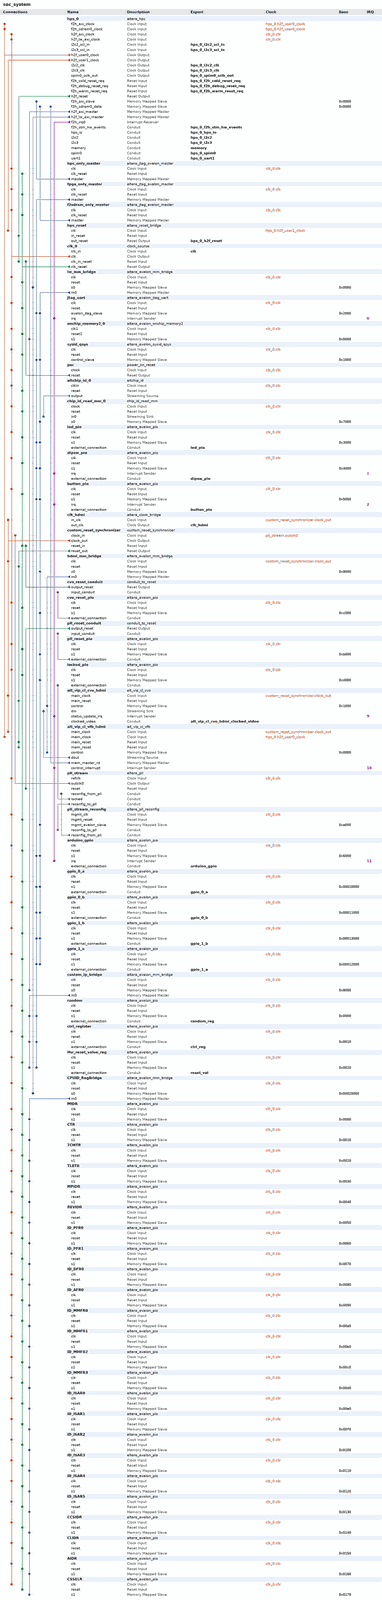
[diagram p0: system contents, whole]
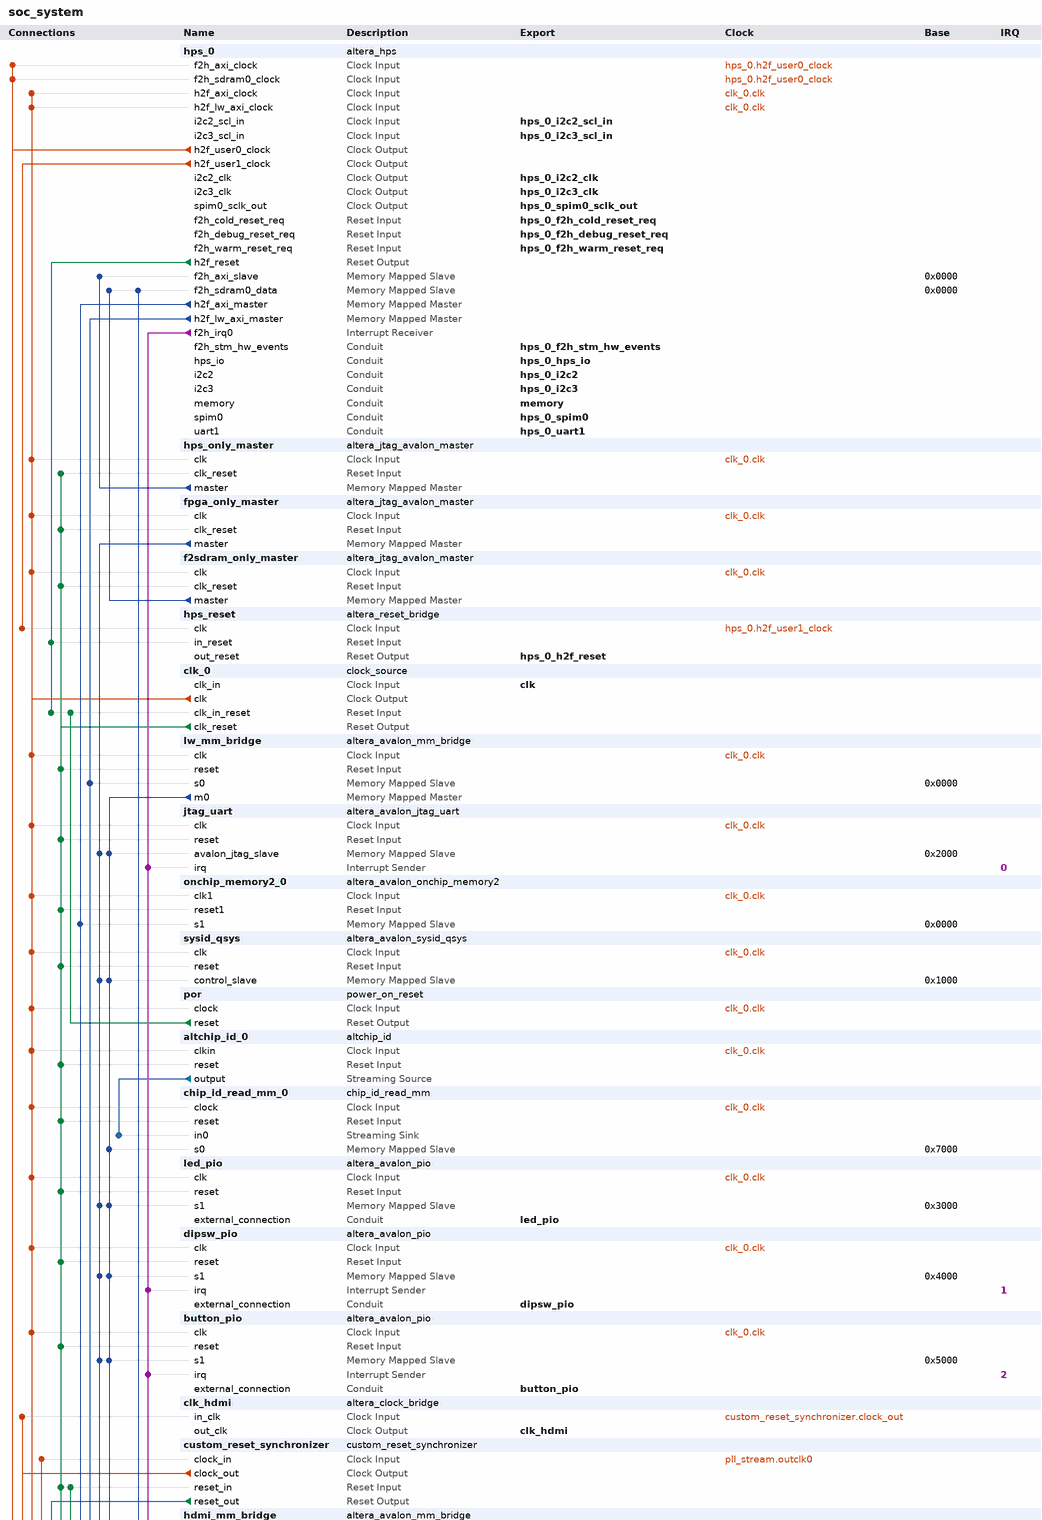
[diagram p1: system contents, upper part]
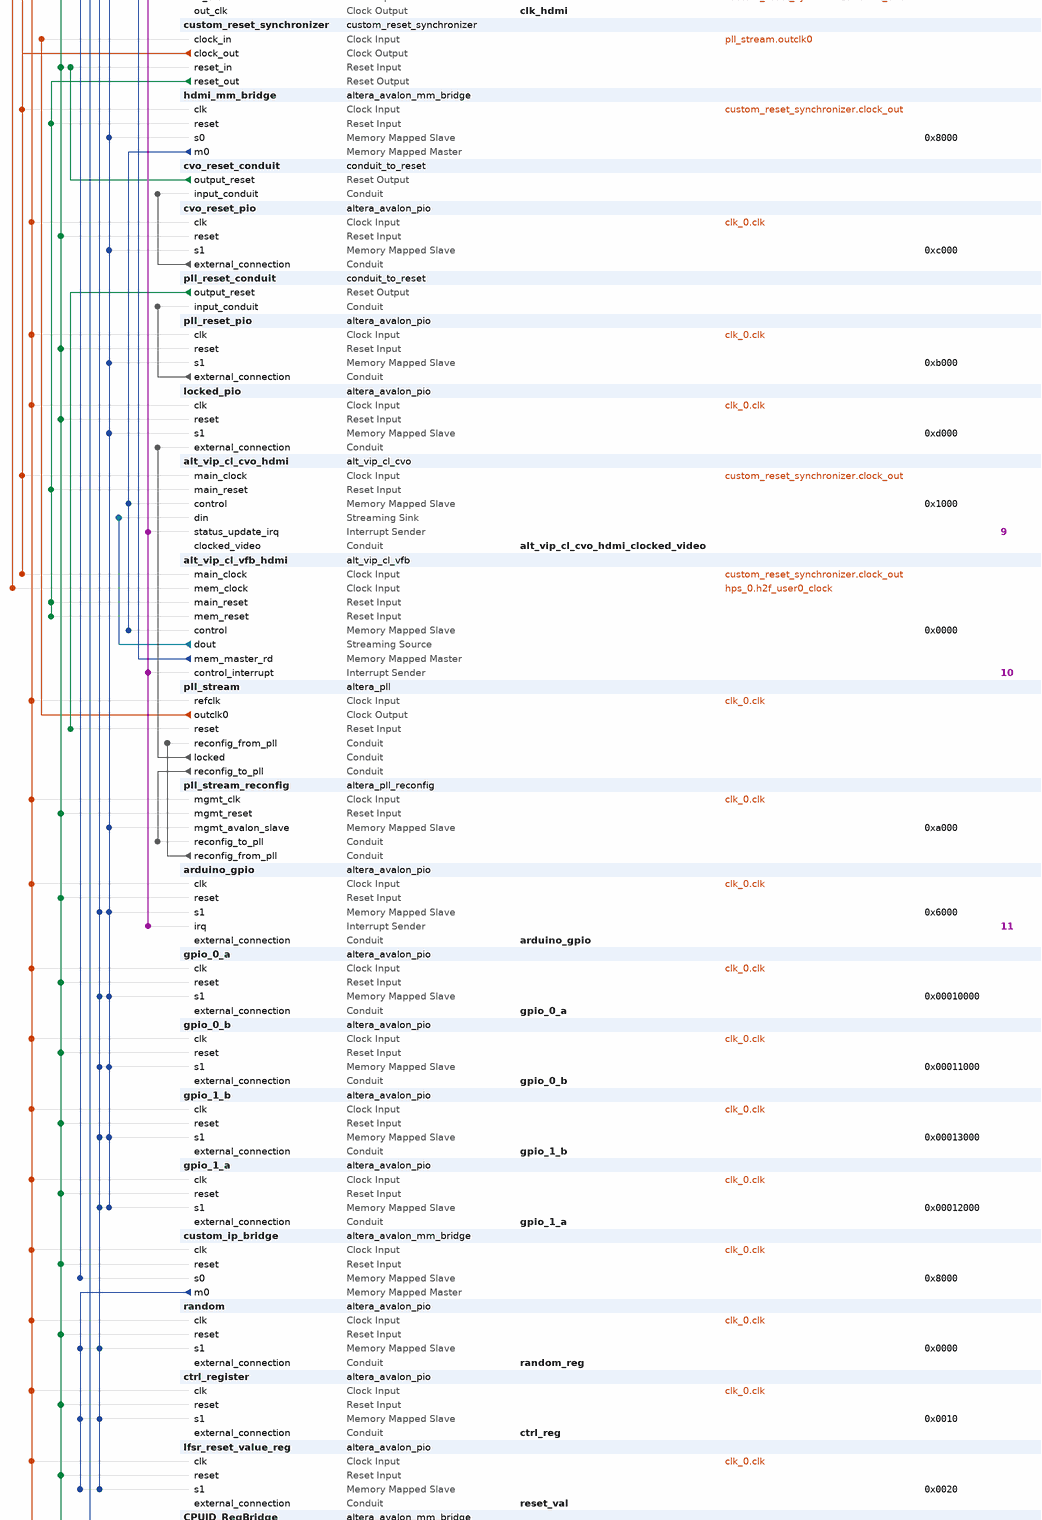
[diagram p2: system contents, middle part]
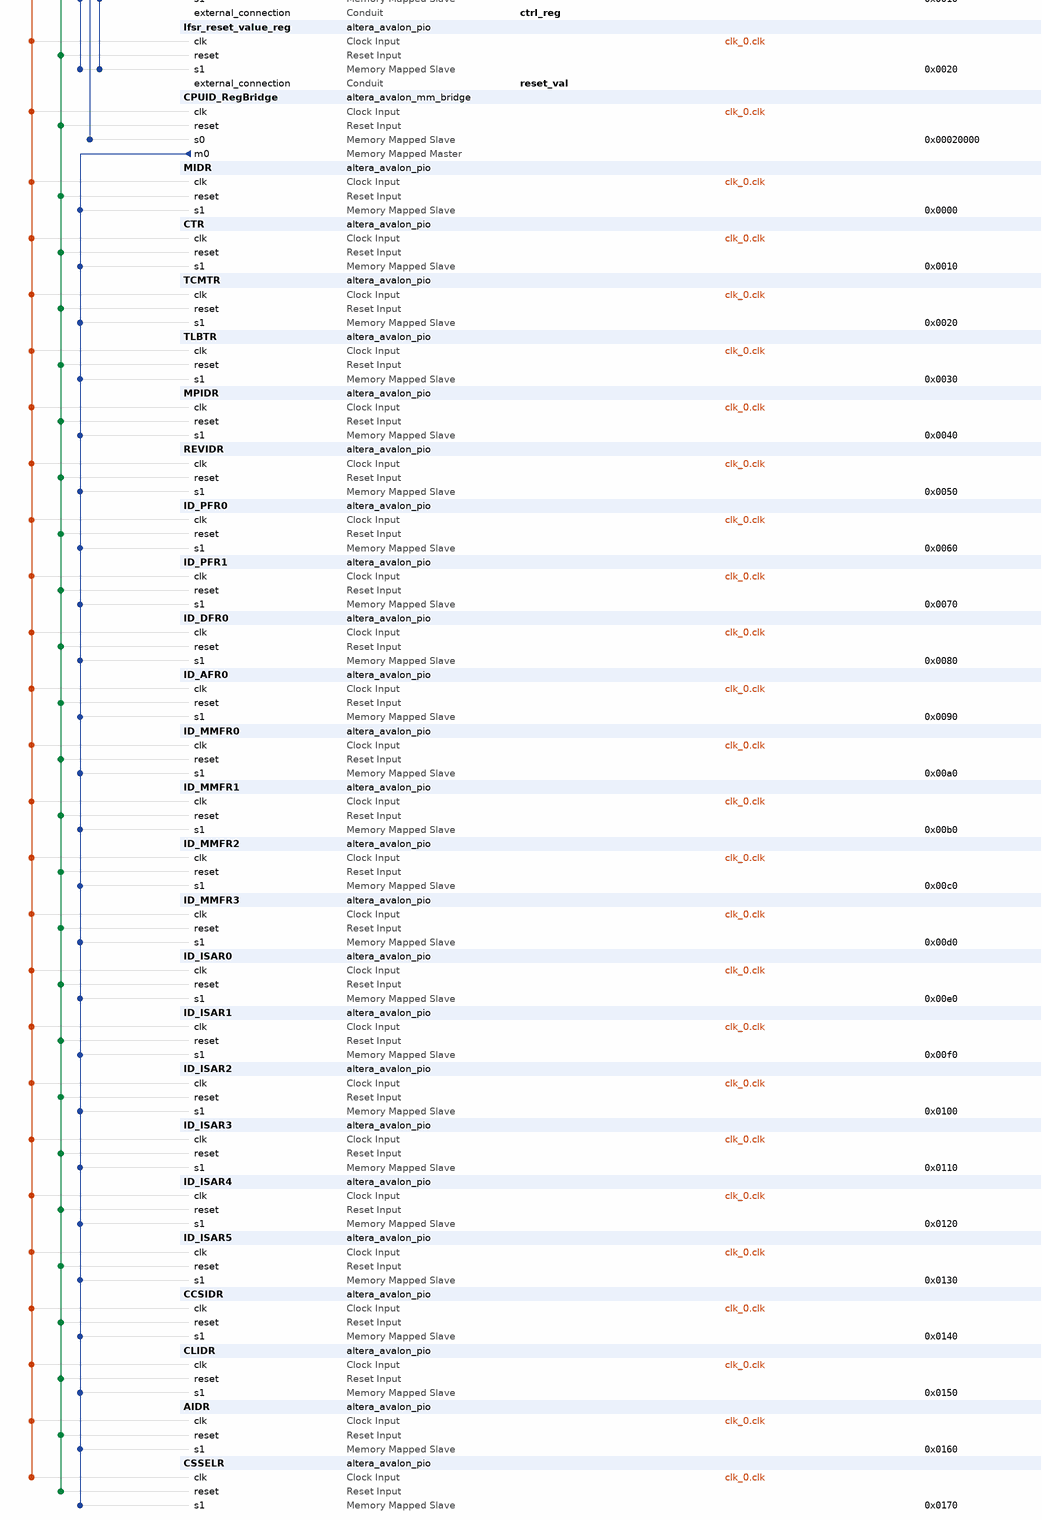
[diagram p3: system contents, lower part]
# Platform Designer (Qsys) system soc_system, Cyclone V 5CSEBA6U23I7
# Parameters at their usual value, and those the tool derives, are not listed.
package require -exact qsys 18.1
create_system soc_system
set_project_property DEVICE_FAMILY {Cyclone V}
set_project_property DEVICE 5CSEBA6U23I7

add_instance hps_0 altera_hps 18.1
set_instance_parameter_value hps_0 EMAC1_Mode RGMII
set_instance_parameter_value hps_0 EMAC1_PinMuxing {HPS I/O Set 0}
set_instance_parameter_value hps_0 F2SCLK_COLDRST_Enable true
set_instance_parameter_value hps_0 F2SCLK_DBGRST_Enable true
set_instance_parameter_value hps_0 F2SCLK_WARMRST_Enable true
set_instance_parameter_value hps_0 F2SDRAM_Type {Avalon-MM Bidirectional}
set_instance_parameter_value hps_0 F2SDRAM_Width 256
set_instance_parameter_value hps_0 F2SINTERRUPT_Enable true
set_instance_parameter_value hps_0 F2S_Width 3
set_instance_parameter_value hps_0 FPGA_PERIPHERAL_OUTPUT_CLOCK_FREQ_EMAC0_GTX_CLK 100
set_instance_parameter_value hps_0 FPGA_PERIPHERAL_OUTPUT_CLOCK_FREQ_EMAC0_MD_CLK 100.0
set_instance_parameter_value hps_0 FPGA_PERIPHERAL_OUTPUT_CLOCK_FREQ_EMAC1_GTX_CLK 100
set_instance_parameter_value hps_0 FPGA_PERIPHERAL_OUTPUT_CLOCK_FREQ_EMAC1_MD_CLK 100.0
set_instance_parameter_value hps_0 HPS_PROTOCOL DDR3
set_instance_parameter_value hps_0 I2C0_Mode I2C
set_instance_parameter_value hps_0 I2C0_PinMuxing {HPS I/O Set 0}
set_instance_parameter_value hps_0 I2C1_Mode I2C
set_instance_parameter_value hps_0 I2C1_PinMuxing {HPS I/O Set 0}
set_instance_parameter_value hps_0 I2C2_Mode Full
set_instance_parameter_value hps_0 I2C2_PinMuxing FPGA
set_instance_parameter_value hps_0 I2C3_Mode Full
set_instance_parameter_value hps_0 I2C3_PinMuxing FPGA
set_instance_parameter_value hps_0 LWH2F_Enable true
set_instance_parameter_value hps_0 MEM_BANKADDR_WIDTH 3
set_instance_parameter_value hps_0 MEM_CLK_FREQ 400.0
set_instance_parameter_value hps_0 MEM_COL_ADDR_WIDTH 10
set_instance_parameter_value hps_0 MEM_DQ_WIDTH 32
set_instance_parameter_value hps_0 MEM_DRV_STR RZQ/6
set_instance_parameter_value hps_0 MEM_ROW_ADDR_WIDTH 15
set_instance_parameter_value hps_0 MEM_RTT_NOM RZQ/6
set_instance_parameter_value hps_0 MEM_RTT_WR {Dynamic ODT off}
set_instance_parameter_value hps_0 MEM_TCL 7
set_instance_parameter_value hps_0 MEM_TFAW_NS 37.5
set_instance_parameter_value hps_0 MEM_TRAS_NS 35.0
set_instance_parameter_value hps_0 MEM_TRCD_NS 13.75
set_instance_parameter_value hps_0 MEM_TRFC_NS 300.0
set_instance_parameter_value hps_0 MEM_TRP_NS 13.75
set_instance_parameter_value hps_0 MEM_VENDOR Other
set_instance_parameter_value hps_0 MEM_WTCL 7
set_instance_parameter_value hps_0 QSPI_Mode N/A
set_instance_parameter_value hps_0 QSPI_PinMuxing Unused
set_instance_parameter_value hps_0 REF_CLK_FREQ 25.0
set_instance_parameter_value hps_0 S2FCLK_USER0CLK_Enable true
set_instance_parameter_value hps_0 S2FCLK_USER1CLK_Enable true
set_instance_parameter_value hps_0 S2FCLK_USER1CLK_FREQ 50.0
set_instance_parameter_value hps_0 S2FCLK_USER2CLK 5
set_instance_parameter_value hps_0 S2F_Width 2
set_instance_parameter_value hps_0 SDIO_Mode {4-bit Data}
set_instance_parameter_value hps_0 SDIO_PinMuxing {HPS I/O Set 0}
set_instance_parameter_value hps_0 SPIM0_Mode Full
set_instance_parameter_value hps_0 SPIM0_PinMuxing FPGA
set_instance_parameter_value hps_0 SPIM1_Mode {Single Slave Select}
set_instance_parameter_value hps_0 SPIM1_PinMuxing {HPS I/O Set 0}
set_instance_parameter_value hps_0 STM_Enable true
set_instance_parameter_value hps_0 TIMING_BOARD_AC_SKEW 0.02
set_instance_parameter_value hps_0 TIMING_BOARD_AC_TO_CK_SKEW 0.0
set_instance_parameter_value hps_0 TIMING_BOARD_DQ_TO_DQS_SKEW 0.0
set_instance_parameter_value hps_0 TIMING_BOARD_MAX_CK_DELAY 0.6
set_instance_parameter_value hps_0 TIMING_BOARD_MAX_DQS_DELAY 0.6
set_instance_parameter_value hps_0 TIMING_BOARD_SKEW_BETWEEN_DQS 0.02
set_instance_parameter_value hps_0 TIMING_BOARD_SKEW_CKDQS_DIMM_MAX 0.01
set_instance_parameter_value hps_0 TIMING_BOARD_SKEW_CKDQS_DIMM_MIN -0.01
set_instance_parameter_value hps_0 TIMING_BOARD_SKEW_WITHIN_DQS 0.02
set_instance_parameter_value hps_0 TIMING_TDH 125
set_instance_parameter_value hps_0 TIMING_TDQSCK 400
set_instance_parameter_value hps_0 TIMING_TDQSQ 120
set_instance_parameter_value hps_0 TIMING_TDS 50
set_instance_parameter_value hps_0 TIMING_TIH 250
set_instance_parameter_value hps_0 TIMING_TIS 175
set_instance_parameter_value hps_0 TIMING_TQSH 0.38
set_instance_parameter_value hps_0 UART0_Mode {No Flow Control}
set_instance_parameter_value hps_0 UART0_PinMuxing {HPS I/O Set 0}
set_instance_parameter_value hps_0 UART1_Mode Full
set_instance_parameter_value hps_0 UART1_PinMuxing FPGA
set_instance_parameter_value hps_0 USB1_Mode SDR
set_instance_parameter_value hps_0 USB1_PinMuxing {HPS I/O Set 0}
set_instance_parameter_value hps_0 desired_cfg_clk_mhz 100.0
set_instance_parameter_value hps_0 desired_qspi_clk_mhz 370.0
set_instance_parameter_value hps_0 use_default_mpu_clk false

add_instance hps_only_master altera_jtag_avalon_master 18.1

add_instance fpga_only_master altera_jtag_avalon_master 18.1

add_instance f2sdram_only_master altera_jtag_avalon_master 18.1

add_instance hps_reset altera_reset_bridge 18.1
set_instance_parameter_value hps_reset ACTIVE_LOW_RESET 1
set_instance_parameter_value hps_reset SYNCHRONOUS_EDGES deassert

add_instance clk_0 clock_source 18.1
set_instance_parameter_value clk_0 clockFrequency 50000000

add_instance lw_mm_bridge altera_avalon_mm_bridge 18.1
set_instance_parameter_value lw_mm_bridge ADDRESS_UNITS SYMBOLS
set_instance_parameter_value lw_mm_bridge ADDRESS_WIDTH 10
set_instance_parameter_value lw_mm_bridge DATA_WIDTH 32
set_instance_parameter_value lw_mm_bridge MAX_PENDING_RESPONSES 4
set_instance_parameter_value lw_mm_bridge USE_AUTO_ADDRESS_WIDTH 1

add_instance jtag_uart altera_avalon_jtag_uart 18.1
set_instance_parameter_value jtag_uart allowMultipleConnections true
set_instance_parameter_value jtag_uart simInteractiveOptions INTERACTIVE_ASCII_OUTPUT

add_instance onchip_memory2_0 altera_avalon_onchip_memory2 18.1
set_instance_parameter_value onchip_memory2_0 dataWidth 32
set_instance_parameter_value onchip_memory2_0 dualPort false
set_instance_parameter_value onchip_memory2_0 initMemContent true
set_instance_parameter_value onchip_memory2_0 initializationFileName onchip_mem.hex
set_instance_parameter_value onchip_memory2_0 memorySize 32768

add_instance sysid_qsys altera_avalon_sysid_qsys 18.1
set_instance_parameter_value sysid_qsys id -1395321854

add_instance por power_on_reset 1.0
set_instance_parameter_value por POR_COUNT 20

add_instance altchip_id_0 altchip_id 18.1
set_instance_parameter_value altchip_id_0 ID_VALUE 18446744073709551615

add_instance chip_id_read_mm_0 chip_id_read_mm 1.0

add_instance led_pio altera_avalon_pio 18.1
set_instance_parameter_value led_pio direction Output
set_instance_parameter_value led_pio width 8

add_instance dipsw_pio altera_avalon_pio 18.1
set_instance_parameter_value dipsw_pio bitClearingEdgeCapReg true
set_instance_parameter_value dipsw_pio captureEdge true
set_instance_parameter_value dipsw_pio direction Input
set_instance_parameter_value dipsw_pio edgeType ANY
set_instance_parameter_value dipsw_pio generateIRQ true
set_instance_parameter_value dipsw_pio irqType EDGE
set_instance_parameter_value dipsw_pio width 4

add_instance button_pio altera_avalon_pio 18.1
set_instance_parameter_value button_pio bitClearingEdgeCapReg true
set_instance_parameter_value button_pio captureEdge true
set_instance_parameter_value button_pio direction Input
set_instance_parameter_value button_pio edgeType FALLING
set_instance_parameter_value button_pio generateIRQ true
set_instance_parameter_value button_pio irqType EDGE
set_instance_parameter_value button_pio width 2

add_instance clk_hdmi altera_clock_bridge 18.1
set_instance_parameter_value clk_hdmi DERIVED_CLOCK_RATE 148500000
set_instance_parameter_value clk_hdmi EXPLICIT_CLOCK_RATE 0

add_instance custom_reset_synchronizer custom_reset_synchronizer 16.1
set_instance_parameter_value custom_reset_synchronizer ADDITIONAL_DEPTH 2
set_instance_parameter_value custom_reset_synchronizer DERIVED_CLOCK_RATE 148500000
set_instance_parameter_value custom_reset_synchronizer DISABLE_GLOBAL_NETWORK 1
set_instance_parameter_value custom_reset_synchronizer INPUT_CLOCK_FREQUENCY 148500000
set_instance_parameter_value custom_reset_synchronizer INPUT_CLOCK_KNOWN 1
set_instance_parameter_value custom_reset_synchronizer SYNC_BOTH_EDGES 0
set_instance_parameter_value custom_reset_synchronizer SYNC_DEPTH 3

add_instance hdmi_mm_bridge altera_avalon_mm_bridge 18.1
set_instance_parameter_value hdmi_mm_bridge ADDRESS_UNITS SYMBOLS
set_instance_parameter_value hdmi_mm_bridge ADDRESS_WIDTH 10
set_instance_parameter_value hdmi_mm_bridge DATA_WIDTH 32
set_instance_parameter_value hdmi_mm_bridge MAX_PENDING_RESPONSES 4
set_instance_parameter_value hdmi_mm_bridge USE_AUTO_ADDRESS_WIDTH 1

add_instance cvo_reset_conduit conduit_to_reset 1.0
set_instance_parameter_value cvo_reset_conduit INPUT_CONDUIT_ROLE export

add_instance cvo_reset_pio altera_avalon_pio 18.1
set_instance_parameter_value cvo_reset_pio bitModifyingOutReg true
set_instance_parameter_value cvo_reset_pio direction Output
set_instance_parameter_value cvo_reset_pio width 1

add_instance pll_reset_conduit conduit_to_reset 1.0
set_instance_parameter_value pll_reset_conduit INPUT_CONDUIT_ROLE export

add_instance pll_reset_pio altera_avalon_pio 18.1
set_instance_parameter_value pll_reset_pio bitModifyingOutReg true
set_instance_parameter_value pll_reset_pio direction Output
set_instance_parameter_value pll_reset_pio width 1

add_instance locked_pio altera_avalon_pio 18.1
set_instance_parameter_value locked_pio bitModifyingOutReg true
set_instance_parameter_value locked_pio direction Input
set_instance_parameter_value locked_pio width 1

add_instance alt_vip_cl_cvo_hdmi alt_vip_cl_cvo 18.1
set_instance_parameter_value alt_vip_cl_cvo_hdmi ACCEPT_COLOURS_IN_SEQ 0
set_instance_parameter_value alt_vip_cl_cvo_hdmi ACCEPT_SYNC 0
set_instance_parameter_value alt_vip_cl_cvo_hdmi ANC_LINE 0
set_instance_parameter_value alt_vip_cl_cvo_hdmi AP_LINE 0
set_instance_parameter_value alt_vip_cl_cvo_hdmi BPS 8
set_instance_parameter_value alt_vip_cl_cvo_hdmi CLOCKS_ARE_SAME 0
set_instance_parameter_value alt_vip_cl_cvo_hdmi COLOUR_PLANES_ARE_IN_PARALLEL 1
set_instance_parameter_value alt_vip_cl_cvo_hdmi CONTEXT_WIDTH 8
set_instance_parameter_value alt_vip_cl_cvo_hdmi COUNT_STEP_IS_PIP_VALUE 0
set_instance_parameter_value alt_vip_cl_cvo_hdmi DST_WIDTH 8
set_instance_parameter_value alt_vip_cl_cvo_hdmi FIELD0_ANC_LINE 0
set_instance_parameter_value alt_vip_cl_cvo_hdmi FIELD0_V_BACK_PORCH 0
set_instance_parameter_value alt_vip_cl_cvo_hdmi FIELD0_V_BLANK 0
set_instance_parameter_value alt_vip_cl_cvo_hdmi FIELD0_V_FRONT_PORCH 0
set_instance_parameter_value alt_vip_cl_cvo_hdmi FIELD0_V_RISING_EDGE 0
set_instance_parameter_value alt_vip_cl_cvo_hdmi FIELD0_V_SYNC_LENGTH 0
set_instance_parameter_value alt_vip_cl_cvo_hdmi FIFO_DEPTH 1920
set_instance_parameter_value alt_vip_cl_cvo_hdmi F_FALLING_EDGE 0
set_instance_parameter_value alt_vip_cl_cvo_hdmi F_RISING_EDGE 0
set_instance_parameter_value alt_vip_cl_cvo_hdmi GENERATE_SYNC 0
set_instance_parameter_value alt_vip_cl_cvo_hdmi H_ACTIVE_PIXELS 1920
set_instance_parameter_value alt_vip_cl_cvo_hdmi H_BACK_PORCH 64
set_instance_parameter_value alt_vip_cl_cvo_hdmi H_BLANK 0
set_instance_parameter_value alt_vip_cl_cvo_hdmi H_FRONT_PORCH 32
set_instance_parameter_value alt_vip_cl_cvo_hdmi H_SYNC_LENGTH 32
set_instance_parameter_value alt_vip_cl_cvo_hdmi INTERLACED 0
set_instance_parameter_value alt_vip_cl_cvo_hdmi LOW_LATENCY 0
set_instance_parameter_value alt_vip_cl_cvo_hdmi NO_OF_CHANNELS 1
set_instance_parameter_value alt_vip_cl_cvo_hdmi NO_OF_MODES 1
set_instance_parameter_value alt_vip_cl_cvo_hdmi NUMBER_OF_COLOUR_PLANES 4
set_instance_parameter_value alt_vip_cl_cvo_hdmi PIXELS_IN_PARALLEL 1
set_instance_parameter_value alt_vip_cl_cvo_hdmi SRC_WIDTH 8
set_instance_parameter_value alt_vip_cl_cvo_hdmi STD_WIDTH 1
set_instance_parameter_value alt_vip_cl_cvo_hdmi TASK_WIDTH 8
set_instance_parameter_value alt_vip_cl_cvo_hdmi THRESHOLD 1919
set_instance_parameter_value alt_vip_cl_cvo_hdmi USE_CONTROL 1
set_instance_parameter_value alt_vip_cl_cvo_hdmi USE_EMBEDDED_SYNCS 0
set_instance_parameter_value alt_vip_cl_cvo_hdmi V_ACTIVE_LINES 1080
set_instance_parameter_value alt_vip_cl_cvo_hdmi V_BACK_PORCH 27
set_instance_parameter_value alt_vip_cl_cvo_hdmi V_BLANK 0
set_instance_parameter_value alt_vip_cl_cvo_hdmi V_FRONT_PORCH 1
set_instance_parameter_value alt_vip_cl_cvo_hdmi V_SYNC_LENGTH 3

add_instance alt_vip_cl_vfb_hdmi alt_vip_cl_vfb 18.1
set_instance_parameter_value alt_vip_cl_vfb_hdmi CLOCKS_ARE_SEPARATE 1
set_instance_parameter_value alt_vip_cl_vfb_hdmi DROP_FRAMES 0
set_instance_parameter_value alt_vip_cl_vfb_hdmi DROP_REPEAT_USER 0
set_instance_parameter_value alt_vip_cl_vfb_hdmi IS_FRAME_READER 1
set_instance_parameter_value alt_vip_cl_vfb_hdmi LINE_BASED_BUFFERING 0
set_instance_parameter_value alt_vip_cl_vfb_hdmi MAX_HEIGHT 1080
set_instance_parameter_value alt_vip_cl_vfb_hdmi MAX_WIDTH 1920
set_instance_parameter_value alt_vip_cl_vfb_hdmi MEM_BASE_ADDR 0
set_instance_parameter_value alt_vip_cl_vfb_hdmi MEM_BUFFER_OFFSET 16777216
set_instance_parameter_value alt_vip_cl_vfb_hdmi MEM_PORT_WIDTH 256
set_instance_parameter_value alt_vip_cl_vfb_hdmi NUMBER_OF_COLOR_PLANES 4
set_instance_parameter_value alt_vip_cl_vfb_hdmi PRIORITIZE_FMAX 0
set_instance_parameter_value alt_vip_cl_vfb_hdmi READER_RUNTIME_CONTROL 1
set_instance_parameter_value alt_vip_cl_vfb_hdmi READ_FIFO_DEPTH 256
set_instance_parameter_value alt_vip_cl_vfb_hdmi USER_PACKETS_MAX_STORAGE 0
set_instance_parameter_value alt_vip_cl_vfb_hdmi USE_BUFFER_OFFSET 0
set_instance_parameter_value alt_vip_cl_vfb_hdmi WRITE_BURST_TARGET 2
set_instance_parameter_value alt_vip_cl_vfb_hdmi WRITE_FIFO_DEPTH 8

add_instance pll_stream altera_pll 18.1
set_instance_parameter_value pll_stream gui_device_speed_grade 2
set_instance_parameter_value pll_stream gui_en_reconf true
set_instance_parameter_value pll_stream gui_number_of_clocks 1
set_instance_parameter_value pll_stream gui_operation_mode direct
set_instance_parameter_value pll_stream gui_output_clock_frequency0 148.5
set_instance_parameter_value pll_stream gui_pll_mode {Fractional-N PLL}
set_instance_parameter_value pll_stream gui_reference_clock_frequency 50.0
set_instance_parameter_value pll_stream gui_use_locked true

add_instance pll_stream_reconfig altera_pll_reconfig 18.1
set_instance_parameter_value pll_stream_reconfig ENABLE_BYTEENABLE true

add_instance arduino_gpio altera_avalon_pio 18.1
set_instance_parameter_value arduino_gpio bitClearingEdgeCapReg true
set_instance_parameter_value arduino_gpio bitModifyingOutReg true
set_instance_parameter_value arduino_gpio captureEdge true
set_instance_parameter_value arduino_gpio direction Bidir
set_instance_parameter_value arduino_gpio generateIRQ true
set_instance_parameter_value arduino_gpio irqType EDGE
set_instance_parameter_value arduino_gpio width 8

add_instance gpio_0_a altera_avalon_pio 18.1
set_instance_parameter_value gpio_0_a bitClearingEdgeCapReg true
set_instance_parameter_value gpio_0_a bitModifyingOutReg true
set_instance_parameter_value gpio_0_a captureEdge true
set_instance_parameter_value gpio_0_a direction Bidir
set_instance_parameter_value gpio_0_a irqType EDGE
set_instance_parameter_value gpio_0_a width 18

add_instance gpio_0_b altera_avalon_pio 18.1
set_instance_parameter_value gpio_0_b bitClearingEdgeCapReg true
set_instance_parameter_value gpio_0_b bitModifyingOutReg true
set_instance_parameter_value gpio_0_b captureEdge true
set_instance_parameter_value gpio_0_b direction Bidir
set_instance_parameter_value gpio_0_b irqType EDGE
set_instance_parameter_value gpio_0_b width 18

add_instance gpio_1_b altera_avalon_pio 18.1
set_instance_parameter_value gpio_1_b bitClearingEdgeCapReg true
set_instance_parameter_value gpio_1_b bitModifyingOutReg true
set_instance_parameter_value gpio_1_b captureEdge true
set_instance_parameter_value gpio_1_b direction Bidir
set_instance_parameter_value gpio_1_b irqType EDGE
set_instance_parameter_value gpio_1_b width 18

add_instance gpio_1_a altera_avalon_pio 18.1
set_instance_parameter_value gpio_1_a bitClearingEdgeCapReg true
set_instance_parameter_value gpio_1_a bitModifyingOutReg true
set_instance_parameter_value gpio_1_a captureEdge true
set_instance_parameter_value gpio_1_a direction Bidir
set_instance_parameter_value gpio_1_a irqType EDGE
set_instance_parameter_value gpio_1_a width 18

add_instance custom_ip_bridge altera_avalon_mm_bridge 18.1
set_instance_parameter_value custom_ip_bridge ADDRESS_UNITS SYMBOLS
set_instance_parameter_value custom_ip_bridge ADDRESS_WIDTH 10
set_instance_parameter_value custom_ip_bridge DATA_WIDTH 32
set_instance_parameter_value custom_ip_bridge MAX_PENDING_RESPONSES 16
set_instance_parameter_value custom_ip_bridge USE_AUTO_ADDRESS_WIDTH 1

add_instance random altera_avalon_pio 18.1
set_instance_parameter_value random direction Input
set_instance_parameter_value random width 32

add_instance ctrl_register altera_avalon_pio 18.1
set_instance_parameter_value ctrl_register direction Output
set_instance_parameter_value ctrl_register width 2

add_instance lfsr_reset_value_reg altera_avalon_pio 18.1
set_instance_parameter_value lfsr_reset_value_reg direction Output
set_instance_parameter_value lfsr_reset_value_reg resetValue 1063321489
set_instance_parameter_value lfsr_reset_value_reg width 32

add_instance CPUID_RegBridge altera_avalon_mm_bridge 18.1
set_instance_parameter_value CPUID_RegBridge ADDRESS_UNITS SYMBOLS
set_instance_parameter_value CPUID_RegBridge ADDRESS_WIDTH 10
set_instance_parameter_value CPUID_RegBridge DATA_WIDTH 32
set_instance_parameter_value CPUID_RegBridge MAX_PENDING_RESPONSES 32
set_instance_parameter_value CPUID_RegBridge USE_AUTO_ADDRESS_WIDTH 1

add_instance MIDR altera_avalon_pio 18.1
set_instance_parameter_value MIDR direction Output
set_instance_parameter_value MIDR width 32

add_instance CTR altera_avalon_pio 18.1
set_instance_parameter_value CTR direction Output
set_instance_parameter_value CTR width 32

add_instance TCMTR altera_avalon_pio 18.1
set_instance_parameter_value TCMTR direction Output
set_instance_parameter_value TCMTR width 32

add_instance TLBTR altera_avalon_pio 18.1
set_instance_parameter_value TLBTR direction Output
set_instance_parameter_value TLBTR width 32

add_instance MPIDR altera_avalon_pio 18.1
set_instance_parameter_value MPIDR direction Output
set_instance_parameter_value MPIDR width 32

add_instance REVIDR altera_avalon_pio 18.1
set_instance_parameter_value REVIDR direction Output
set_instance_parameter_value REVIDR width 32

add_instance ID_PFR0 altera_avalon_pio 18.1
set_instance_parameter_value ID_PFR0 direction Output
set_instance_parameter_value ID_PFR0 width 32

add_instance ID_PFR1 altera_avalon_pio 18.1
set_instance_parameter_value ID_PFR1 direction Output
set_instance_parameter_value ID_PFR1 width 32

add_instance ID_DFR0 altera_avalon_pio 18.1
set_instance_parameter_value ID_DFR0 direction Output
set_instance_parameter_value ID_DFR0 width 32

add_instance ID_AFR0 altera_avalon_pio 18.1
set_instance_parameter_value ID_AFR0 direction Output
set_instance_parameter_value ID_AFR0 width 32

add_instance ID_MMFR0 altera_avalon_pio 18.1
set_instance_parameter_value ID_MMFR0 direction Output
set_instance_parameter_value ID_MMFR0 width 32

add_instance ID_MMFR1 altera_avalon_pio 18.1
set_instance_parameter_value ID_MMFR1 direction Output
set_instance_parameter_value ID_MMFR1 width 32

add_instance ID_MMFR2 altera_avalon_pio 18.1
set_instance_parameter_value ID_MMFR2 direction Output
set_instance_parameter_value ID_MMFR2 width 32

add_instance ID_MMFR3 altera_avalon_pio 18.1
set_instance_parameter_value ID_MMFR3 direction Output
set_instance_parameter_value ID_MMFR3 width 32

add_instance ID_ISAR0 altera_avalon_pio 18.1
set_instance_parameter_value ID_ISAR0 direction Output
set_instance_parameter_value ID_ISAR0 width 32

add_instance ID_ISAR1 altera_avalon_pio 18.1
set_instance_parameter_value ID_ISAR1 direction Output
set_instance_parameter_value ID_ISAR1 width 32

add_instance ID_ISAR2 altera_avalon_pio 18.1
set_instance_parameter_value ID_ISAR2 direction Output
set_instance_parameter_value ID_ISAR2 width 32

add_instance ID_ISAR3 altera_avalon_pio 18.1
set_instance_parameter_value ID_ISAR3 direction Output
set_instance_parameter_value ID_ISAR3 width 32

add_instance ID_ISAR4 altera_avalon_pio 18.1
set_instance_parameter_value ID_ISAR4 direction Output
set_instance_parameter_value ID_ISAR4 width 32

add_instance ID_ISAR5 altera_avalon_pio 18.1
set_instance_parameter_value ID_ISAR5 direction Output
set_instance_parameter_value ID_ISAR5 width 32

add_instance CCSIDR altera_avalon_pio 18.1
set_instance_parameter_value CCSIDR direction Output
set_instance_parameter_value CCSIDR width 32

add_instance CLIDR altera_avalon_pio 18.1
set_instance_parameter_value CLIDR direction Output
set_instance_parameter_value CLIDR width 32

add_instance AIDR altera_avalon_pio 18.1
set_instance_parameter_value AIDR direction Output
set_instance_parameter_value AIDR width 32

add_instance CSSELR altera_avalon_pio 18.1
set_instance_parameter_value CSSELR direction Output
set_instance_parameter_value CSSELR width 32

# connections
add_connection clk_0.clk AIDR.clk clock
add_connection clk_0.clk altchip_id_0.clkin clock
add_connection clk_0.clk arduino_gpio.clk clock
add_connection clk_0.clk button_pio.clk clock
add_connection clk_0.clk CCSIDR.clk clock
add_connection clk_0.clk chip_id_read_mm_0.clock clock
add_connection clk_0.clk CLIDR.clk clock
add_connection clk_0.clk CPUID_RegBridge.clk clock
add_connection clk_0.clk CSSELR.clk clock
add_connection clk_0.clk CTR.clk clock
add_connection clk_0.clk ctrl_register.clk clock
add_connection clk_0.clk custom_ip_bridge.clk clock
add_connection clk_0.clk cvo_reset_pio.clk clock
add_connection clk_0.clk dipsw_pio.clk clock
add_connection clk_0.clk f2sdram_only_master.clk clock
add_connection clk_0.clk fpga_only_master.clk clock
add_connection clk_0.clk gpio_0_a.clk clock
add_connection clk_0.clk gpio_0_b.clk clock
add_connection clk_0.clk gpio_1_a.clk clock
add_connection clk_0.clk gpio_1_b.clk clock
add_connection clk_0.clk hps_0.h2f_axi_clock clock
add_connection clk_0.clk hps_0.h2f_lw_axi_clock clock
add_connection clk_0.clk hps_only_master.clk clock
add_connection clk_0.clk ID_AFR0.clk clock
add_connection clk_0.clk ID_DFR0.clk clock
add_connection clk_0.clk ID_ISAR0.clk clock
add_connection clk_0.clk ID_ISAR1.clk clock
add_connection clk_0.clk ID_ISAR2.clk clock
add_connection clk_0.clk ID_ISAR3.clk clock
add_connection clk_0.clk ID_ISAR4.clk clock
add_connection clk_0.clk ID_ISAR5.clk clock
add_connection clk_0.clk ID_MMFR0.clk clock
add_connection clk_0.clk ID_MMFR1.clk clock
add_connection clk_0.clk ID_MMFR2.clk clock
add_connection clk_0.clk ID_MMFR3.clk clock
add_connection clk_0.clk ID_PFR0.clk clock
add_connection clk_0.clk ID_PFR1.clk clock
add_connection clk_0.clk jtag_uart.clk clock
add_connection clk_0.clk led_pio.clk clock
add_connection clk_0.clk lfsr_reset_value_reg.clk clock
add_connection clk_0.clk locked_pio.clk clock
add_connection clk_0.clk lw_mm_bridge.clk clock
add_connection clk_0.clk MIDR.clk clock
add_connection clk_0.clk MPIDR.clk clock
add_connection clk_0.clk onchip_memory2_0.clk1 clock
add_connection clk_0.clk pll_reset_pio.clk clock
add_connection clk_0.clk pll_stream.refclk clock
add_connection clk_0.clk pll_stream_reconfig.mgmt_clk clock
add_connection clk_0.clk por.clock clock
add_connection clk_0.clk random.clk clock
add_connection clk_0.clk REVIDR.clk clock
add_connection clk_0.clk sysid_qsys.clk clock
add_connection clk_0.clk TCMTR.clk clock
add_connection clk_0.clk TLBTR.clk clock
add_connection custom_reset_synchronizer.clock_out alt_vip_cl_cvo_hdmi.main_clock clock
add_connection custom_reset_synchronizer.clock_out alt_vip_cl_vfb_hdmi.main_clock clock
add_connection custom_reset_synchronizer.clock_out clk_hdmi.in_clk clock
add_connection custom_reset_synchronizer.clock_out hdmi_mm_bridge.clk clock
add_connection hps_0.h2f_user0_clock alt_vip_cl_vfb_hdmi.mem_clock clock
add_connection hps_0.h2f_user0_clock hps_0.f2h_axi_clock clock
add_connection hps_0.h2f_user0_clock hps_0.f2h_sdram0_clock clock
add_connection hps_0.h2f_user1_clock hps_reset.clk clock
add_connection pll_stream.outclk0 custom_reset_synchronizer.clock_in clock
add_connection clk_0.clk_reset AIDR.reset reset
add_connection clk_0.clk_reset altchip_id_0.reset reset
add_connection clk_0.clk_reset arduino_gpio.reset reset
add_connection clk_0.clk_reset button_pio.reset reset
add_connection clk_0.clk_reset CCSIDR.reset reset
add_connection clk_0.clk_reset chip_id_read_mm_0.reset reset
add_connection clk_0.clk_reset CLIDR.reset reset
add_connection clk_0.clk_reset CPUID_RegBridge.reset reset
add_connection clk_0.clk_reset CSSELR.reset reset
add_connection clk_0.clk_reset CTR.reset reset
add_connection clk_0.clk_reset ctrl_register.reset reset
add_connection clk_0.clk_reset custom_ip_bridge.reset reset
add_connection clk_0.clk_reset custom_reset_synchronizer.reset_in reset
add_connection clk_0.clk_reset cvo_reset_pio.reset reset
add_connection clk_0.clk_reset dipsw_pio.reset reset
add_connection clk_0.clk_reset f2sdram_only_master.clk_reset reset
add_connection clk_0.clk_reset fpga_only_master.clk_reset reset
add_connection clk_0.clk_reset gpio_0_a.reset reset
add_connection clk_0.clk_reset gpio_0_b.reset reset
add_connection clk_0.clk_reset gpio_1_a.reset reset
add_connection clk_0.clk_reset gpio_1_b.reset reset
add_connection clk_0.clk_reset hps_only_master.clk_reset reset
add_connection clk_0.clk_reset ID_AFR0.reset reset
add_connection clk_0.clk_reset ID_DFR0.reset reset
add_connection clk_0.clk_reset ID_ISAR0.reset reset
add_connection clk_0.clk_reset ID_ISAR1.reset reset
add_connection clk_0.clk_reset ID_ISAR2.reset reset
add_connection clk_0.clk_reset ID_ISAR3.reset reset
add_connection clk_0.clk_reset ID_ISAR4.reset reset
add_connection clk_0.clk_reset ID_ISAR5.reset reset
add_connection clk_0.clk_reset ID_MMFR0.reset reset
add_connection clk_0.clk_reset ID_MMFR1.reset reset
add_connection clk_0.clk_reset ID_MMFR2.reset reset
add_connection clk_0.clk_reset ID_MMFR3.reset reset
add_connection clk_0.clk_reset ID_PFR0.reset reset
add_connection clk_0.clk_reset ID_PFR1.reset reset
add_connection clk_0.clk_reset jtag_uart.reset reset
add_connection clk_0.clk_reset led_pio.reset reset
add_connection clk_0.clk_reset lfsr_reset_value_reg.reset reset
add_connection clk_0.clk_reset locked_pio.reset reset
add_connection clk_0.clk_reset lw_mm_bridge.reset reset
add_connection clk_0.clk_reset MIDR.reset reset
add_connection clk_0.clk_reset MPIDR.reset reset
add_connection clk_0.clk_reset onchip_memory2_0.reset1 reset
add_connection clk_0.clk_reset pll_reset_pio.reset reset
add_connection clk_0.clk_reset pll_stream_reconfig.mgmt_reset reset
add_connection clk_0.clk_reset random.reset reset
add_connection clk_0.clk_reset REVIDR.reset reset
add_connection clk_0.clk_reset sysid_qsys.reset reset
add_connection clk_0.clk_reset TCMTR.reset reset
add_connection clk_0.clk_reset TLBTR.reset reset
add_connection custom_reset_synchronizer.reset_out alt_vip_cl_cvo_hdmi.main_reset reset
add_connection custom_reset_synchronizer.reset_out alt_vip_cl_vfb_hdmi.main_reset reset
add_connection custom_reset_synchronizer.reset_out alt_vip_cl_vfb_hdmi.mem_reset reset
add_connection custom_reset_synchronizer.reset_out hdmi_mm_bridge.reset reset
add_connection cvo_reset_conduit.output_reset custom_reset_synchronizer.reset_in reset
add_connection hps_0.h2f_reset clk_0.clk_in_reset reset
add_connection hps_0.h2f_reset hps_reset.in_reset reset
add_connection pll_reset_conduit.output_reset pll_stream.reset reset
add_connection por.reset clk_0.clk_in_reset reset
add_connection alt_vip_cl_vfb_hdmi.mem_master_rd hps_0.f2h_sdram0_data avalon
set_connection_parameter_value alt_vip_cl_vfb_hdmi.mem_master_rd/hps_0.f2h_sdram0_data baseAddress 0x0000
add_connection CPUID_RegBridge.m0 AIDR.s1 avalon
set_connection_parameter_value CPUID_RegBridge.m0/AIDR.s1 baseAddress 0x0160
add_connection CPUID_RegBridge.m0 CCSIDR.s1 avalon
set_connection_parameter_value CPUID_RegBridge.m0/CCSIDR.s1 baseAddress 0x0140
add_connection CPUID_RegBridge.m0 CLIDR.s1 avalon
set_connection_parameter_value CPUID_RegBridge.m0/CLIDR.s1 baseAddress 0x0150
add_connection CPUID_RegBridge.m0 CSSELR.s1 avalon
set_connection_parameter_value CPUID_RegBridge.m0/CSSELR.s1 baseAddress 0x0170
add_connection CPUID_RegBridge.m0 CTR.s1 avalon
set_connection_parameter_value CPUID_RegBridge.m0/CTR.s1 baseAddress 0x0010
add_connection CPUID_RegBridge.m0 ID_AFR0.s1 avalon
set_connection_parameter_value CPUID_RegBridge.m0/ID_AFR0.s1 baseAddress 0x0090
add_connection CPUID_RegBridge.m0 ID_DFR0.s1 avalon
set_connection_parameter_value CPUID_RegBridge.m0/ID_DFR0.s1 baseAddress 0x0080
add_connection CPUID_RegBridge.m0 ID_ISAR0.s1 avalon
set_connection_parameter_value CPUID_RegBridge.m0/ID_ISAR0.s1 baseAddress 0x00e0
add_connection CPUID_RegBridge.m0 ID_ISAR1.s1 avalon
set_connection_parameter_value CPUID_RegBridge.m0/ID_ISAR1.s1 baseAddress 0x00f0
add_connection CPUID_RegBridge.m0 ID_ISAR2.s1 avalon
set_connection_parameter_value CPUID_RegBridge.m0/ID_ISAR2.s1 baseAddress 0x0100
add_connection CPUID_RegBridge.m0 ID_ISAR3.s1 avalon
set_connection_parameter_value CPUID_RegBridge.m0/ID_ISAR3.s1 baseAddress 0x0110
add_connection CPUID_RegBridge.m0 ID_ISAR4.s1 avalon
set_connection_parameter_value CPUID_RegBridge.m0/ID_ISAR4.s1 baseAddress 0x0120
add_connection CPUID_RegBridge.m0 ID_ISAR5.s1 avalon
set_connection_parameter_value CPUID_RegBridge.m0/ID_ISAR5.s1 baseAddress 0x0130
add_connection CPUID_RegBridge.m0 ID_MMFR0.s1 avalon
set_connection_parameter_value CPUID_RegBridge.m0/ID_MMFR0.s1 baseAddress 0x00a0
add_connection CPUID_RegBridge.m0 ID_MMFR1.s1 avalon
set_connection_parameter_value CPUID_RegBridge.m0/ID_MMFR1.s1 baseAddress 0x00b0
add_connection CPUID_RegBridge.m0 ID_MMFR2.s1 avalon
set_connection_parameter_value CPUID_RegBridge.m0/ID_MMFR2.s1 baseAddress 0x00c0
add_connection CPUID_RegBridge.m0 ID_MMFR3.s1 avalon
set_connection_parameter_value CPUID_RegBridge.m0/ID_MMFR3.s1 baseAddress 0x00d0
add_connection CPUID_RegBridge.m0 ID_PFR0.s1 avalon
set_connection_parameter_value CPUID_RegBridge.m0/ID_PFR0.s1 baseAddress 0x0060
add_connection CPUID_RegBridge.m0 ID_PFR1.s1 avalon
set_connection_parameter_value CPUID_RegBridge.m0/ID_PFR1.s1 baseAddress 0x0070
add_connection CPUID_RegBridge.m0 MIDR.s1 avalon
set_connection_parameter_value CPUID_RegBridge.m0/MIDR.s1 baseAddress 0x0000
add_connection CPUID_RegBridge.m0 MPIDR.s1 avalon
set_connection_parameter_value CPUID_RegBridge.m0/MPIDR.s1 baseAddress 0x0040
add_connection CPUID_RegBridge.m0 REVIDR.s1 avalon
set_connection_parameter_value CPUID_RegBridge.m0/REVIDR.s1 baseAddress 0x0050
add_connection CPUID_RegBridge.m0 TCMTR.s1 avalon
set_connection_parameter_value CPUID_RegBridge.m0/TCMTR.s1 baseAddress 0x0020
add_connection CPUID_RegBridge.m0 TLBTR.s1 avalon
set_connection_parameter_value CPUID_RegBridge.m0/TLBTR.s1 baseAddress 0x0030
add_connection custom_ip_bridge.m0 ctrl_register.s1 avalon
set_connection_parameter_value custom_ip_bridge.m0/ctrl_register.s1 baseAddress 0x0010
add_connection custom_ip_bridge.m0 lfsr_reset_value_reg.s1 avalon
set_connection_parameter_value custom_ip_bridge.m0/lfsr_reset_value_reg.s1 baseAddress 0x0020
add_connection custom_ip_bridge.m0 random.s1 avalon
set_connection_parameter_value custom_ip_bridge.m0/random.s1 baseAddress 0x0000
add_connection f2sdram_only_master.master hps_0.f2h_sdram0_data avalon
set_connection_parameter_value f2sdram_only_master.master/hps_0.f2h_sdram0_data baseAddress 0x0000
add_connection fpga_only_master.master arduino_gpio.s1 avalon
set_connection_parameter_value fpga_only_master.master/arduino_gpio.s1 baseAddress 0x6000
add_connection fpga_only_master.master button_pio.s1 avalon
set_connection_parameter_value fpga_only_master.master/button_pio.s1 baseAddress 0x5000
add_connection fpga_only_master.master ctrl_register.s1 avalon
set_connection_parameter_value fpga_only_master.master/ctrl_register.s1 baseAddress 0x0010
add_connection fpga_only_master.master dipsw_pio.s1 avalon
set_connection_parameter_value fpga_only_master.master/dipsw_pio.s1 baseAddress 0x4000
add_connection fpga_only_master.master gpio_0_a.s1 avalon
set_connection_parameter_value fpga_only_master.master/gpio_0_a.s1 baseAddress 0x00010000
add_connection fpga_only_master.master gpio_0_b.s1 avalon
set_connection_parameter_value fpga_only_master.master/gpio_0_b.s1 baseAddress 0x00011000
add_connection fpga_only_master.master gpio_1_a.s1 avalon
set_connection_parameter_value fpga_only_master.master/gpio_1_a.s1 baseAddress 0x00012000
add_connection fpga_only_master.master gpio_1_b.s1 avalon
set_connection_parameter_value fpga_only_master.master/gpio_1_b.s1 baseAddress 0x00013000
add_connection fpga_only_master.master jtag_uart.avalon_jtag_slave avalon
set_connection_parameter_value fpga_only_master.master/jtag_uart.avalon_jtag_slave baseAddress 0x2000
add_connection fpga_only_master.master led_pio.s1 avalon
set_connection_parameter_value fpga_only_master.master/led_pio.s1 baseAddress 0x3000
add_connection fpga_only_master.master lfsr_reset_value_reg.s1 avalon
set_connection_parameter_value fpga_only_master.master/lfsr_reset_value_reg.s1 baseAddress 0x0020
add_connection fpga_only_master.master random.s1 avalon
set_connection_parameter_value fpga_only_master.master/random.s1 baseAddress 0x0000
add_connection fpga_only_master.master sysid_qsys.control_slave avalon
set_connection_parameter_value fpga_only_master.master/sysid_qsys.control_slave baseAddress 0x1000
add_connection hdmi_mm_bridge.m0 alt_vip_cl_cvo_hdmi.control avalon
set_connection_parameter_value hdmi_mm_bridge.m0/alt_vip_cl_cvo_hdmi.control baseAddress 0x1000
add_connection hdmi_mm_bridge.m0 alt_vip_cl_vfb_hdmi.control avalon
set_connection_parameter_value hdmi_mm_bridge.m0/alt_vip_cl_vfb_hdmi.control baseAddress 0x0000
add_connection hps_0.h2f_axi_master custom_ip_bridge.s0 avalon
set_connection_parameter_value hps_0.h2f_axi_master/custom_ip_bridge.s0 baseAddress 0x8000
add_connection hps_0.h2f_axi_master onchip_memory2_0.s1 avalon
set_connection_parameter_value hps_0.h2f_axi_master/onchip_memory2_0.s1 baseAddress 0x0000
add_connection hps_0.h2f_lw_axi_master CPUID_RegBridge.s0 avalon
set_connection_parameter_value hps_0.h2f_lw_axi_master/CPUID_RegBridge.s0 baseAddress 0x00020000
add_connection hps_0.h2f_lw_axi_master lw_mm_bridge.s0 avalon
set_connection_parameter_value hps_0.h2f_lw_axi_master/lw_mm_bridge.s0 baseAddress 0x0000
add_connection hps_only_master.master hps_0.f2h_axi_slave avalon
set_connection_parameter_value hps_only_master.master/hps_0.f2h_axi_slave baseAddress 0x0000
add_connection lw_mm_bridge.m0 arduino_gpio.s1 avalon
set_connection_parameter_value lw_mm_bridge.m0/arduino_gpio.s1 baseAddress 0x6000
add_connection lw_mm_bridge.m0 button_pio.s1 avalon
set_connection_parameter_value lw_mm_bridge.m0/button_pio.s1 baseAddress 0x5000
add_connection lw_mm_bridge.m0 chip_id_read_mm_0.s0 avalon
set_connection_parameter_value lw_mm_bridge.m0/chip_id_read_mm_0.s0 baseAddress 0x7000
add_connection lw_mm_bridge.m0 cvo_reset_pio.s1 avalon
set_connection_parameter_value lw_mm_bridge.m0/cvo_reset_pio.s1 baseAddress 0xc000
add_connection lw_mm_bridge.m0 dipsw_pio.s1 avalon
set_connection_parameter_value lw_mm_bridge.m0/dipsw_pio.s1 baseAddress 0x4000
add_connection lw_mm_bridge.m0 gpio_0_a.s1 avalon
set_connection_parameter_value lw_mm_bridge.m0/gpio_0_a.s1 baseAddress 0x00010000
add_connection lw_mm_bridge.m0 gpio_0_b.s1 avalon
set_connection_parameter_value lw_mm_bridge.m0/gpio_0_b.s1 baseAddress 0x00011000
add_connection lw_mm_bridge.m0 gpio_1_a.s1 avalon
set_connection_parameter_value lw_mm_bridge.m0/gpio_1_a.s1 baseAddress 0x00012000
add_connection lw_mm_bridge.m0 gpio_1_b.s1 avalon
set_connection_parameter_value lw_mm_bridge.m0/gpio_1_b.s1 baseAddress 0x00013000
add_connection lw_mm_bridge.m0 hdmi_mm_bridge.s0 avalon
set_connection_parameter_value lw_mm_bridge.m0/hdmi_mm_bridge.s0 baseAddress 0x8000
add_connection lw_mm_bridge.m0 jtag_uart.avalon_jtag_slave avalon
set_connection_parameter_value lw_mm_bridge.m0/jtag_uart.avalon_jtag_slave baseAddress 0x2000
add_connection lw_mm_bridge.m0 led_pio.s1 avalon
set_connection_parameter_value lw_mm_bridge.m0/led_pio.s1 baseAddress 0x3000
add_connection lw_mm_bridge.m0 locked_pio.s1 avalon
set_connection_parameter_value lw_mm_bridge.m0/locked_pio.s1 baseAddress 0xd000
add_connection lw_mm_bridge.m0 pll_reset_pio.s1 avalon
set_connection_parameter_value lw_mm_bridge.m0/pll_reset_pio.s1 baseAddress 0xb000
add_connection lw_mm_bridge.m0 pll_stream_reconfig.mgmt_avalon_slave avalon
set_connection_parameter_value lw_mm_bridge.m0/pll_stream_reconfig.mgmt_avalon_slave baseAddress 0xa000
add_connection lw_mm_bridge.m0 sysid_qsys.control_slave avalon
set_connection_parameter_value lw_mm_bridge.m0/sysid_qsys.control_slave baseAddress 0x1000
add_connection alt_vip_cl_vfb_hdmi.dout alt_vip_cl_cvo_hdmi.din avalon_streaming
add_connection altchip_id_0.output chip_id_read_mm_0.in0 avalon_streaming
add_connection cvo_reset_pio.external_connection cvo_reset_conduit.input_conduit conduit
add_connection pll_reset_pio.external_connection pll_reset_conduit.input_conduit conduit
add_connection pll_stream.locked locked_pio.external_connection conduit
add_connection pll_stream.reconfig_to_pll pll_stream_reconfig.reconfig_to_pll conduit
add_connection pll_stream_reconfig.reconfig_from_pll pll_stream.reconfig_from_pll conduit
add_connection hps_0.f2h_irq0 alt_vip_cl_cvo_hdmi.status_update_irq interrupt
set_connection_parameter_value hps_0.f2h_irq0/alt_vip_cl_cvo_hdmi.status_update_irq irqNumber 9
add_connection hps_0.f2h_irq0 alt_vip_cl_vfb_hdmi.control_interrupt interrupt
set_connection_parameter_value hps_0.f2h_irq0/alt_vip_cl_vfb_hdmi.control_interrupt irqNumber 10
add_connection hps_0.f2h_irq0 arduino_gpio.irq interrupt
set_connection_parameter_value hps_0.f2h_irq0/arduino_gpio.irq irqNumber 11
add_connection hps_0.f2h_irq0 button_pio.irq interrupt
set_connection_parameter_value hps_0.f2h_irq0/button_pio.irq irqNumber 2
add_connection hps_0.f2h_irq0 dipsw_pio.irq interrupt
set_connection_parameter_value hps_0.f2h_irq0/dipsw_pio.irq irqNumber 1
add_connection hps_0.f2h_irq0 jtag_uart.irq interrupt
set_connection_parameter_value hps_0.f2h_irq0/jtag_uart.irq irqNumber 0

# exported interfaces
add_interface alt_vip_cl_cvo_hdmi_clocked_video conduit end
set_interface_property alt_vip_cl_cvo_hdmi_clocked_video EXPORT_OF alt_vip_cl_cvo_hdmi.clocked_video
add_interface arduino_gpio conduit end
set_interface_property arduino_gpio EXPORT_OF arduino_gpio.external_connection
add_interface button_pio conduit end
set_interface_property button_pio EXPORT_OF button_pio.external_connection
add_interface clk clock sink
set_interface_property clk EXPORT_OF clk_0.clk_in
add_interface clk_hdmi clock source
set_interface_property clk_hdmi EXPORT_OF clk_hdmi.out_clk
add_interface ctrl_reg conduit end
set_interface_property ctrl_reg EXPORT_OF ctrl_register.external_connection
add_interface dipsw_pio conduit end
set_interface_property dipsw_pio EXPORT_OF dipsw_pio.external_connection
add_interface gpio_0_a conduit end
set_interface_property gpio_0_a EXPORT_OF gpio_0_a.external_connection
add_interface gpio_0_b conduit end
set_interface_property gpio_0_b EXPORT_OF gpio_0_b.external_connection
add_interface gpio_1_a conduit end
set_interface_property gpio_1_a EXPORT_OF gpio_1_a.external_connection
add_interface gpio_1_b conduit end
set_interface_property gpio_1_b EXPORT_OF gpio_1_b.external_connection
add_interface hps_0_f2h_cold_reset_req reset sink
set_interface_property hps_0_f2h_cold_reset_req EXPORT_OF hps_0.f2h_cold_reset_req
add_interface hps_0_f2h_debug_reset_req reset sink
set_interface_property hps_0_f2h_debug_reset_req EXPORT_OF hps_0.f2h_debug_reset_req
add_interface hps_0_f2h_stm_hw_events conduit end
set_interface_property hps_0_f2h_stm_hw_events EXPORT_OF hps_0.f2h_stm_hw_events
add_interface hps_0_f2h_warm_reset_req reset sink
set_interface_property hps_0_f2h_warm_reset_req EXPORT_OF hps_0.f2h_warm_reset_req
add_interface hps_0_h2f_reset reset source
set_interface_property hps_0_h2f_reset EXPORT_OF hps_reset.out_reset
add_interface hps_0_hps_io conduit end
set_interface_property hps_0_hps_io EXPORT_OF hps_0.hps_io
add_interface hps_0_i2c2 conduit end
set_interface_property hps_0_i2c2 EXPORT_OF hps_0.i2c2
add_interface hps_0_i2c2_clk clock source
set_interface_property hps_0_i2c2_clk EXPORT_OF hps_0.i2c2_clk
add_interface hps_0_i2c2_scl_in clock sink
set_interface_property hps_0_i2c2_scl_in EXPORT_OF hps_0.i2c2_scl_in
add_interface hps_0_i2c3 conduit end
set_interface_property hps_0_i2c3 EXPORT_OF hps_0.i2c3
add_interface hps_0_i2c3_clk clock source
set_interface_property hps_0_i2c3_clk EXPORT_OF hps_0.i2c3_clk
add_interface hps_0_i2c3_scl_in clock sink
set_interface_property hps_0_i2c3_scl_in EXPORT_OF hps_0.i2c3_scl_in
add_interface hps_0_spim0 conduit end
set_interface_property hps_0_spim0 EXPORT_OF hps_0.spim0
add_interface hps_0_spim0_sclk_out clock source
set_interface_property hps_0_spim0_sclk_out EXPORT_OF hps_0.spim0_sclk_out
add_interface hps_0_uart1 conduit end
set_interface_property hps_0_uart1 EXPORT_OF hps_0.uart1
add_interface led_pio conduit end
set_interface_property led_pio EXPORT_OF led_pio.external_connection
add_interface memory conduit end
set_interface_property memory EXPORT_OF hps_0.memory
add_interface random_reg conduit end
set_interface_property random_reg EXPORT_OF random.external_connection
add_interface reset_val conduit end
set_interface_property reset_val EXPORT_OF lfsr_reset_value_reg.external_connection

set_interconnect_requirement {$system} qsys_mm.clockCrossingAdapter HANDSHAKE
set_interconnect_requirement {$system} qsys_mm.enableEccProtection FALSE
set_interconnect_requirement {$system} qsys_mm.insertDefaultSlave FALSE
set_interconnect_requirement {$system} qsys_mm.maxAdditionalLatency 0

save_system soc_system.qsys
